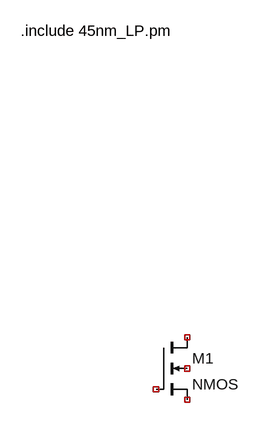
[diagram p0: schematic AMA1_45nm.asc]
AMA1_45nm.asc, the LTspice schematic file:
Version 4
SHEET 1 880 680
SYMBOL nmos4 -928 368 R0
SYMATTR InstName M1
SYMATTR Value2 l=45n w=1u
TEXT -1136 -104 Left 2 !.include 45nm_LP.pm

The netlist it stands for:
* AMA1_45nm.asc
M1 NC_01 NC_02 NC_03 NC_04 NMOS l=45n w=1u
.model NMOS NMOS
.model PMOS PMOS
.lib standard.mos
.include 45nm_LP.pm
.backanno
.end